# EAGLE schematic ExternalMotorControllerRev4 (EAGLE 6.4)

## Sheet 1 of 7
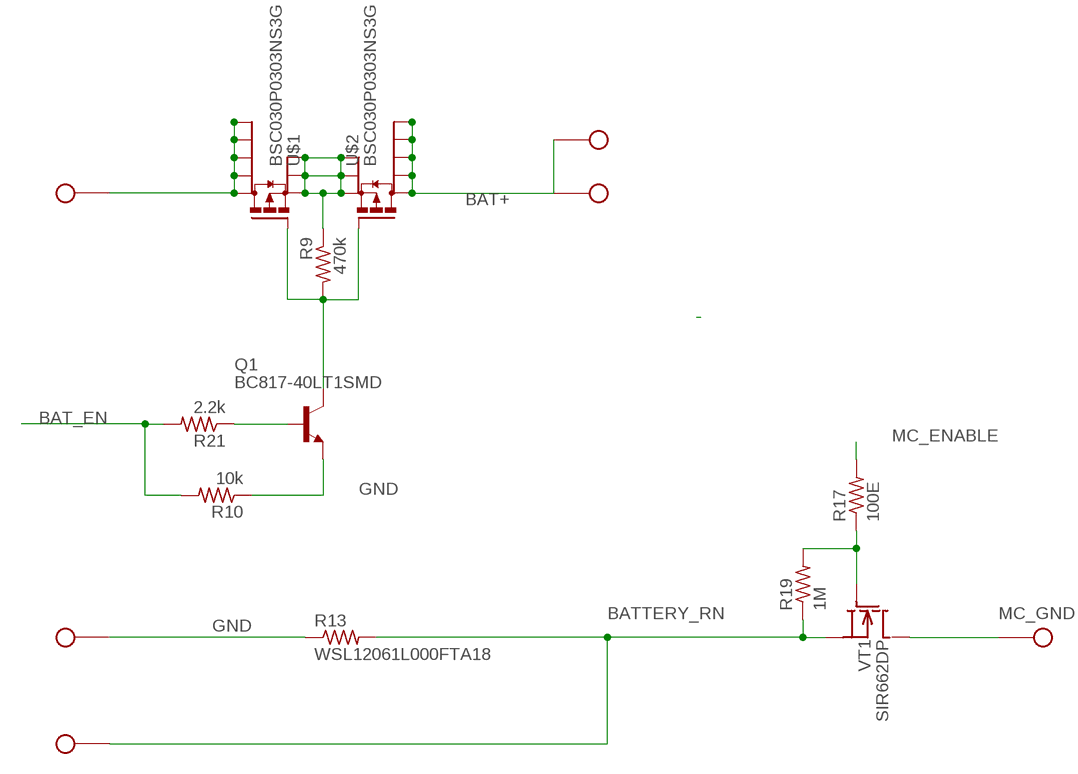
[diagram p0: schematic, sheet 1]

### Parts
Q1  BC817-40LT1SMD  [SOT23-BEC]
R9  470k  R-US_R0402  [R0402]
R10  10k  R-US_R0402  [R0402]
R13  WSL12061L000FTA18  R-US_R2512  [R2512]
R17  100E  R-US_R0402  [R0402]
R19  1M  R-US_R0402  [R0402]
R21  2.2k  R-US_R0402  [R0402]
U$1  BSC030P0303NS3G  [PG-TDSON-8]
U$2  BSC030P0303NS3G  [PG-TDSON-8]
VT1  SIR662DP  [POWERPAK_SO8]
X1  SOLDER_HOLE18AWG  [SOLDER_HOLE_18]
X2  SOLDER_HOLE18AWG  [SOLDER_HOLE_18]
X3  SOLDER_HOLE18AWG  [SOLDER_HOLE_18]
X4  SOLDER_HOLE18AWG  [SOLDER_HOLE_18]
X5  SOLDER_HOLE18AWG  [SOLDER_HOLE_18]
X13  SOLDER_HOLE18AWG  [SOLDER_HOLE_18]

### Nets
BAT+: U$2.5(D) U$2.6(D1) U$2.7(D2) U$2.8(D3) U$2.TH(D4) X1.1 X4.1 ; also sheet 3,4
BAT_EN: R10.2 R21.2 ; also sheet 7
BATTERY_RN: R13.2 R19.1 VT1.S1(S) VT1.S2(S) VT1.S3(S) X3.1 ; also sheet 7
GND: Q1.E R10.1 R13.1 X13.1 ; also sheet 3,4,7
MC_ENABLE: R17.2 ; also sheet 7
MC_GND: VT1.D X2.1
N$1: R9.1 U$1.1(S) U$1.2(S1) U$1.3(S2) U$2.1(S) U$2.2(S1) U$2.3(S2)
N$9: Q1.B R21.1
N$11: Q1.C R9.2 U$1.4(G) U$2.4(G)
N$12: U$1.5(D) U$1.6(D1) U$1.7(D2) U$1.8(D3) U$1.TH(D4) X5.1
N$25: R17.1 R19.2 VT1.G

## Sheet 2 of 7

## Sheet 3 of 7
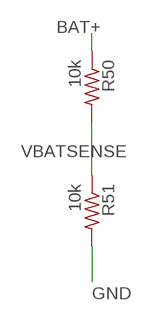
[diagram p1: schematic, sheet 3]

### Parts
R50  10k  R-US_R0402  [R0402]
R51  10k  R-US_R0402  [R0402]

### Nets
BAT+: R50.1 ; also sheet 1,4
GND: R51.2 ; also sheet 1,4,7
VBATSENSE: R50.2 R51.1 ; also sheet 7

## Sheet 4 of 7
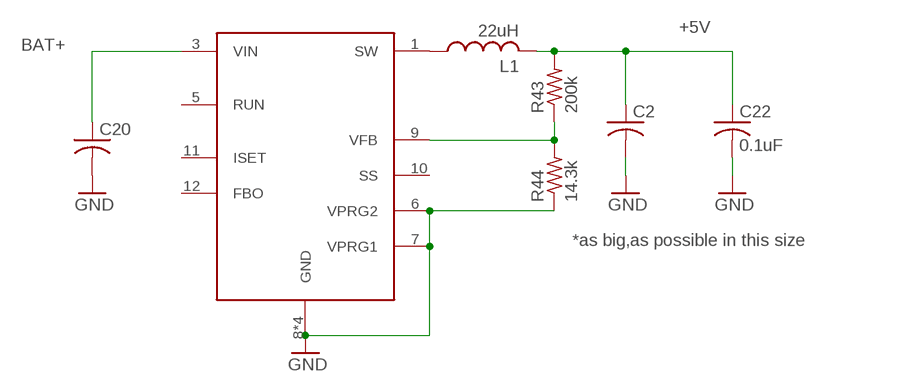
[diagram p2: schematic, sheet 4]

### Parts
C2  C-US  [C2413]
C20  RCL_C-USC0805  [RCL_C0805$1]
C22  0.1uF  C-USC0402  [C0402]
DA2  LTC3630  [MSE16(12)]
L1  22uH  M-PAD-2.1_L_USD  [M-PAD-2.1_1210]
R43  200k  RCL_R-US_R0402  [RCL_R0402]
R44  14.3k  RCL_R-US_R0402  [RCL_R0402]

### Nets
+5V: C2.1 C22.1 L1.2 R43.2 ; also sheet 7
BAT+: C20.1 DA2.3(VIN) ; also sheet 1,3
GND: C2.2 C20.2 C22.2 DA2.6(VPRG2) DA2.7(VPRG1) DA2.8(GND) DA2.14(GND) DA2.16(GND) DA2.17(GND) R44.1 ; also sheet 1,3,7
N$51: DA2.1(SW) L1.1
N$52: DA2.9(VFB) R43.1 R44.2
Unconnected: DA2.5(RUN) DA2.10(SS) DA2.11(ISET) DA2.12(FBO)

### Notes on the sheet
- *as big,as possible in this size

## Sheet 5 of 7

## Sheet 6 of 7

## Sheet 7 of 7
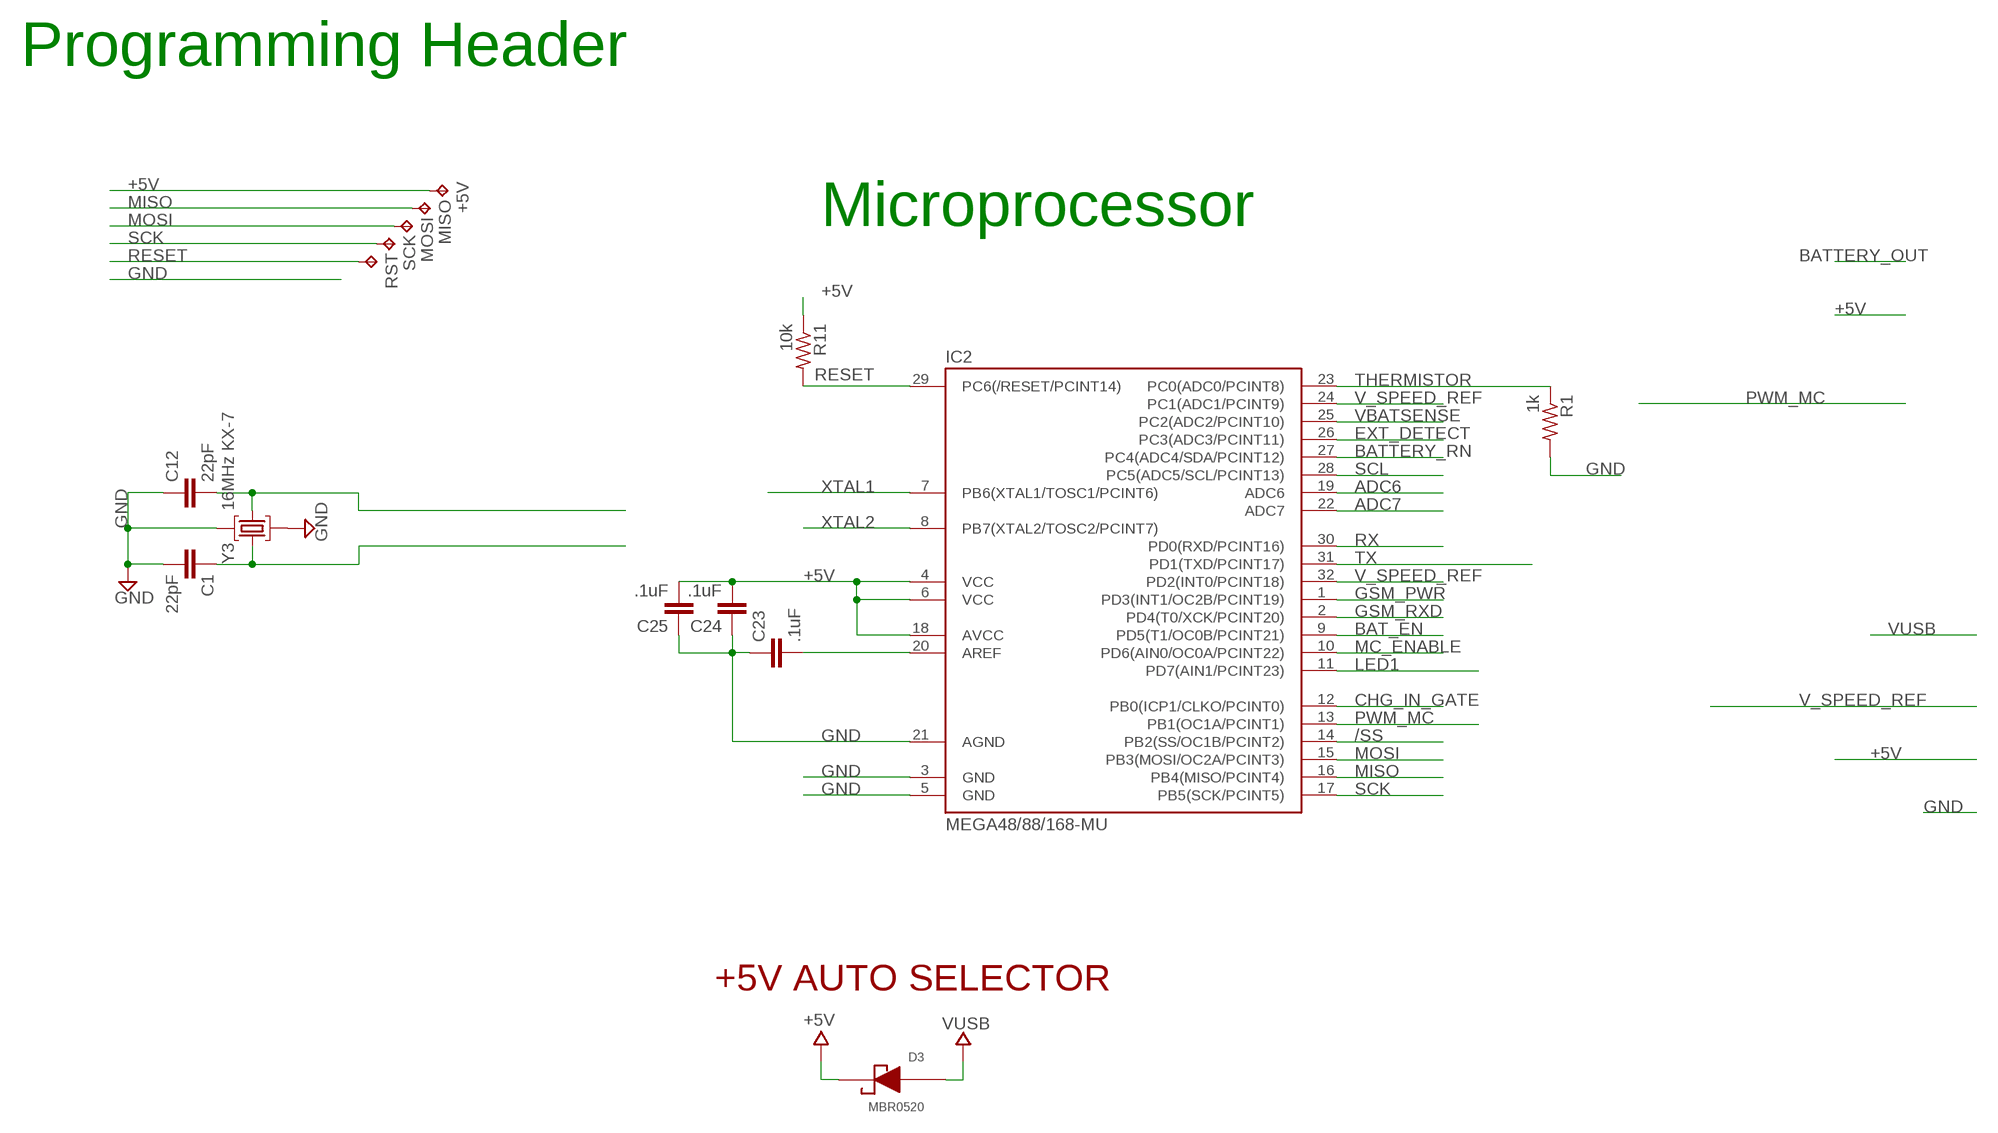
[diagram p3: schematic, sheet 7]

### Parts
+5V  TPTP08R  [TP08R]
C1  22pF  C-EUC0402  [C0402]
C12  22pF  C-EUC0402  [C0402]
C23  .1uF  C-EUC0402  [C0402]
C24  .1uF  C-EUC0402  [C0402]
C25  .1uF  C-EUC0402  [C0402]
D3  MBR0520  [SOD-123]
IC2  MEGA48/88/168-MU  [MLF32]
MISO  TPTP08R  [TP08R]
MOSI  TPTP08R  [TP08R]
R1  1k  R-US_R0402  [R0402]
R11  10k  R-US_R0402  [R0402]
RST  TPTP10R  [TP10R]
SCK  TPTP08R  [TP08R]
Y3  16MHz KX-7  CRYSTAL-3.2-2.5  [CRYSTAL-3.2-2.5]

### Nets
+5V: +5V.TP C24.2 C25.2 D3.1(CA) IC2.4(VCC) IC2.6(VCC) IC2.18(AVCC) R11.1 ; also sheet 4
/SS: IC2.14(PB2(SS/OC1B/PCINT2))
ADC6: IC2.19(ADC6)
ADC7: IC2.22(ADC7)
BAT_EN: IC2.9(PD5(T1/OC0B/PCINT21)) ; also sheet 1
BATTERY_RN: IC2.27(PC4(ADC4/SDA/PCINT12)) ; also sheet 1
CHG_IN_GATE: IC2.12(PB0(ICP1/CLKO/PCINT0))
EXT_DETECT: IC2.26(PC3(ADC3/PCINT11))
GND: C1.2 C12.1 C23.1 C24.1 C25.1 IC2.3(GND) IC2.5(GND) IC2.21(AGND) R1.2 Y3.2(GND) Y3.4(GND) ; also sheet 1,3,4
GSM_PWR: IC2.1(PD3(INT1/OC2B/PCINT19))
GSM_RXD: IC2.2(PD4(T0/XCK/PCINT20))
LED1: IC2.11(PD7(AIN1/PCINT23))
MC_ENABLE: IC2.10(PD6(AIN0/OC0A/PCINT22)) ; also sheet 1
MISO: IC2.16(PB4(MISO/PCINT4)) MISO.TP
MOSI: IC2.15(PB3(MOSI/OC2A/PCINT3)) MOSI.TP
N$36: C23.2 IC2.20(AREF)
PWM_MC: IC2.13(PB1(OC1A/PCINT1))
RESET: IC2.29(PC6(/RESET/PCINT14)) R11.2 RST.TP
RX: IC2.30(PD0(RXD/PCINT16))
SCK: IC2.17(PB5(SCK/PCINT5)) SCK.TP
SCL: IC2.28(PC5(ADC5/SCL/PCINT13))
THERMISTOR: IC2.23(PC0(ADC0/PCINT8)) R1.1
TX: IC2.31(PD1(TXD/PCINT17))
V_SPEED_REF: IC2.24(PC1(ADC1/PCINT9)) IC2.32(PD2(INT0/PCINT18))
VBATSENSE: IC2.25(PC2(ADC2/PCINT10)) ; also sheet 3
VUSB: D3.2(AN)
XTAL1: C1.1 IC2.7(PB6(XTAL1/TOSC1/PCINT6)) Y3.3(C2)
XTAL2: C12.2 IC2.8(PB7(XTAL2/TOSC2/PCINT7)) Y3.1(C1)

### Notes on the sheet
- Programming Header
- Microprocessor
- +5V AUTO SELECTOR

## Library data of the parts
+5V MISO MOSI RST SCK = testpad:TP: Test pad
C1 C23-C25 = rcl:C-EU: CAPACITOR, European symbol
C2 C22 = rcl:C-US: CAPACITOR, American symbol
C12 = SmartPrj:C-EU: CAPACITOR, European symbol
C20 = MotorController_r0:RCL_C-US: CAPACITOR, American symbol
D3 = MySMD:MBR0520
DA2 = my:LTC3630
IC2 = avr-5:MEGA48/88/168
L1 = MotorController_r0:M-PAD-2.1_L_US: Inductors in various packages from: - Sumida - Panasonic - Coilcraft
Q1 = transistor-npn:BC817*: NPN Transistor
R1 R11 R50 R51 = rcl:R-US_: RESISTOR, American symbol
R9 R10 R13 R17 R19 R21 = ForBattery:R-US_: RESISTOR, American symbol
R43 R44 = MotorController_r0:RCL_R-US_: RESISTOR, American symbol
U$1 U$2 = transistor-power:BSC030P0303NS3G
VT1 = ForBattery:SIR662DP
X1-X5 X13 = ForBattery:SOLDER_HOLE
Y3 = SmartPrj:CRYSTAL-3.2-2.5